# Altium project NG2092_R0M0E0.PrjPcb (part 8 of 8)

## Sheet NG2092_EEPROM.SchDoc: =project_title
size Tabloid; PageSetup: Record=PageOptions|CenterHorizontal=True|CenterVertical=True|PrintScale=0.73|XCorrection=1.00|YCorrection=1.00|PrintKind=0|BorderSize=5000000|LeftOffset=0|BottomOffset=0|Orientation=2|PaperLength=1000|PaperWidth=1000|Scale=100|PaperSource=7|PrintQuality=-4|MediaType=1|DitherType=10|PaperKind=A4|PrintScaleMode=1; CompanyName: Luxonis Holding; DrawnBy: Nejc Gostincar; Organization: Luxonis Holding; Address1: 1925 Harmony Park Drive; Address2: Westminster, CO; Address3: 80234; Address4: United States; DocumentNumber: DXXXX; Revision: R0M0E0; SheetNumber: 8; SheetTotal: 12
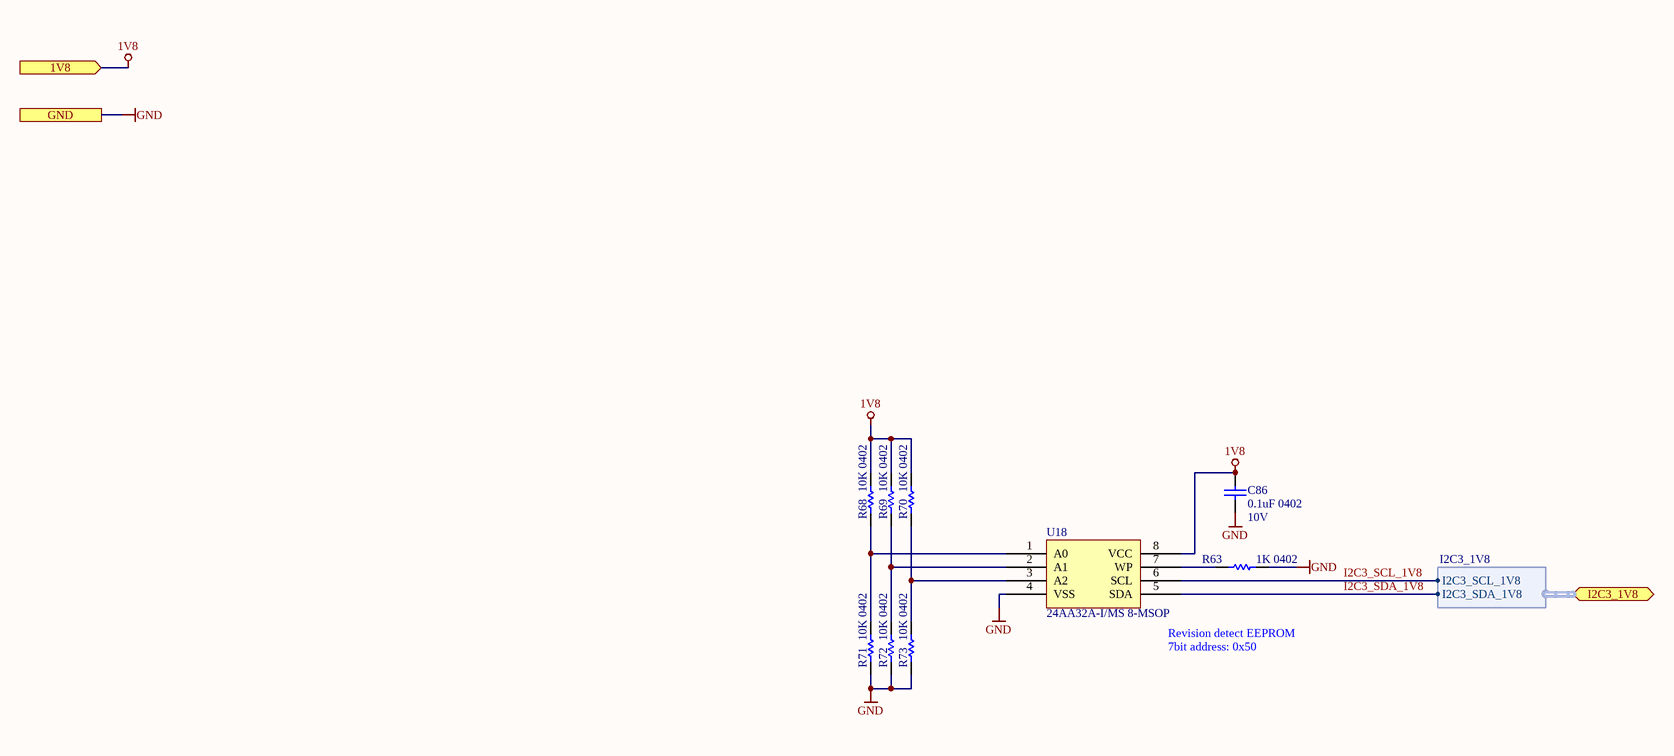
[diagram p17: NG2092_EEPROM.SchDoc]

### Parts
C86  0.1uF 0402  Voltage Rating: 10V  [CAPC0402(1005)70_L]
R63  1K 0402  [RESC0402(1005)_L]
R68  10K 0402  [RESC0402(1005)_L]
R69  10K 0402  [RESC0402(1005)_L]
R70  10K 0402  [RESC0402(1005)_L]
R71  10K 0402  [RESC0402(1005)_L]
R72  10K 0402  [RESC0402(1005)_L]
R73  10K 0402  [RESC0402(1005)_L]
U18  24AA32A-I/MS 8-MSOP  [24AA32A-I/MS]

### Ports
1V8 (in), GND, I2C3_1V8 (bidir, harness I2C3_1V8)

### Harnesses
I2C3_1V8: I2C3_SCL_1V8, I2C3_SDA_1V8

### Nets
1V8: C86.2 R68.2 R69.2 R70.2 U18.8(VCC) ; port 1V8
GND: C86.1 R63.1 R71.1 R72.1 R73.1 U18.4(VSS) ; port GND
I2C3_SCL_1V8: U18.6(SCL) ; port I2C3_1V8.I2C3_SCL_1V8
I2C3_SDA_1V8: U18.5(SDA) ; port I2C3_1V8.I2C3_SDA_1V8
NetR63_2: R63.2 U18.7(WP)
NetR68_1: R68.1 R71.2 U18.1(A0)
NetR69_1: R69.1 R72.2 U18.2(A1)
NetR70_1: R70.1 R73.2 U18.3(A2)

### Notes on the sheet
- (near U18) Revision detect EEPROM
- (near U18) 7bit address: 0x50
- Title
- Size:
- Date:
- Tabloid
- Number:
- Time:
- Revision:
- Sheet
- of
- Drawn by:

### Library data of the parts
C86 = GRM155R71A104JA01D: CAP CER 0.1UF 10V X7R 0402 5%; Manufacturer 1: Murata; Capacitance: 100nF; Supplier 1: Digi-Key; Manufacturer Part Number 1: GRM155R71A104JA01D; Stock 1: 1346709; Pricing 1: 1=0.10000, 10=0.02500, 100=0.01130, 500=0.00806, 1000=0.00633, 2500=0.00575, 5000=0.00529 (USD); RoHS: Yes; Mount: Surface Mount; Case/Package: 0402; Case Code (Imperial): 0402; Case Code (Metric): 1005; Min Operating Temperature: -55°C; Max Operating Temperature: 125°C; Tolerance: 5%; Packaging: Tape and Reel; Voltage Rating (DC): 10V; Dielectric: X7R; Package Quantity: 10000; Termination: SMD/SMT; Length: 1mm; Height: 0.5mm; Width: 0.02inch; Thickness: 0.022inch; Depth: 0.5mm; Radiation Hardening: No; Lead Free: Lead Free; ComponentLink1URL: https://datasheet.ciiva.com/5411/product-5411135.pdf?src-supplier=Mouser; ComponentLink1Description: https://datasheet.ciiva.com/5411/product-5411135.pdf?src-supplier=Mouser; ComponentLink2URL: https://datasheet.ciiva.com/11618/c02e-11618821.pdf?src-supplier=Avnet; ComponentLink2Description: https://datasheet.ciiva.com/11618/c02e-11618821.pdf?src-supplier=Avnet; Supplier Part Number 1: 490-10777-1-ND
R63 = RC0402FR-071KL: RES SMD 1K OHM 1% 1/16W 0402; Manufacturer 1: Yageo; Temperature Coefficient: 100ppm/°C; Power Rating: 62.5mW; Voltage Rating (DC): 50V; Resistance: 1kR; RoHS: Yes; Number of Pins: 2; Case Code (Imperial): 0402; Case Code (Metric): 1005; Min Operating Temperature: -55°C; Max Operating Temperature: 155°C; Packaging: Tape and Reel; Composition: Thick Film; Voltage Rating: 50V; Military Standard: Not; Termination: SMD/SMT; Length: 1mm; Height: 0.32mm; Width: 0.5mm; Depth: 0.5mm; Lead Free: Lead Free; REACH SVHC: Unknown; ComponentLink1URL: https://datasheet.ciiva.com/11819/0900766b80c66297-11819477.pdf?src-supplier=RSComponents; ComponentLink1Description: https://datasheet.ciiva.com/11819/0900766b80c66297-11819477.pdf?src-supplier=RSComponents; ComponentLink2URL: https://datasheet.ciiva.com/12666/pyu-rc0402-51-rohs-l-6-r-12666741.pdf?src-supplier=Mouser; ComponentLink2Description: https://datasheet.ciiva.com/12666/pyu-rc0402-51-rohs-l-6-r-12666741.pdf?src-supplier=Mouser; ComponentLink3URL: https://datasheet.ciiva.com/17063/pyu-rc0402-51-rohs-l-6-r-17063193.pdf?src-supplier=Future+Electronics; ComponentLink3Description: https://datasheet.ciiva.com/17063/pyu-rc0402-51-rohs-l-6-r-17063193.pdf?src-supplier=Future+Electronics; ComponentLink4URL: https://datasheet.ciiva.com/22747/1018594-22747513.pdf?src-supplier=Element14; ComponentLink4Description: https://datasheet.ciiva.com/22747/1018594-22747513.pdf?src-supplier=Element14; ComponentLink5URL: https://datasheet.ciiva.com/7849/1018594-7849869.pdf?src-supplier=Element14; ComponentLink5Description: https://datasheet.ciiva.com/7849/1018594-7849869.pdf?src-supplier=Element14; ComponentLink6URL: https://datasheet.ciiva.com/7983/1018594-7983502.pdf?src-supplier=Element14; ComponentLink6Description: https://datasheet.ciiva.com/7983/1018594-7983502.pdf?src-supplier=Element14; ComponentLink7URL: https://datasheet.ciiva.com/7849/1018594-7849871.pdf?src-supplier=Element14; ComponentLink7Description: https://datasheet.ciiva.com/7849/1018594-7849871.pdf?src-supplier=Element14; Supplier 1: Digi-Key; Manufacturer Part Number 1: RC0402FR-071KL; Stock 1: 60695854; Pricing 1: 1=0.10000, 10=0.01600, 100=0.00670, 1000=0.00301, 2500=0.00261, 5000=0.00215 (USD); Case/Package: 0402; Tolerance: 1%; Supplier Part Number 1: 311-1.00KLRCT-ND
R68-R73 = RC0402FR-1310KL: as R11-R14 on sheet NG2092_USB; ComponentLink1URL: https://datasheet.ciiva.com/16940/pyu-rc0402-51-rohs-l-6-16940293.pdf?src-supplier=Avnet+Europe; ComponentLink1Description: https://datasheet.ciiva.com/16940/pyu-rc0402-51-rohs-l-6-16940293.pdf?src-supplier=Avnet+Europe; ComponentLink2URL: https://datasheet.ciiva.com/28386/pyu-rc0402-51-rohs-l-6-28386855.pdf?src-supplier=Avnet+Europe; ComponentLink2Description: https://datasheet.ciiva.com/28386/pyu-rc0402-51-rohs-l-6-28386855.pdf?src-supplier=Avnet+Europe; ComponentLink3URL: https://datasheet.ciiva.com/16740/pyu-rc0402-51-rohs-l-6-r-16740602.pdf?src-supplier=Future+Electronics; ComponentLink3Description: https://datasheet.ciiva.com/16740/pyu-rc0402-51-rohs-l-6-r-16740602.pdf?src-supplier=Future+Electronics; ComponentLink4URL: https://datasheet.ciiva.com/8891/pyu-rc0402-51-rohs-l-6-8891339.pdf?src-supplier=Avnet; ComponentLink4Description: https://datasheet.ciiva.com/8891/pyu-rc0402-51-rohs-l-6-8891339.pdf?src-supplier=Avnet; ComponentLink5URL: https://datasheet.ciiva.com/5557/pyu-rc0402-51-rohs-l-6-r-5557997.pdf?src-supplier=Mouser; ComponentLink5Description: https://datasheet.ciiva.com/5557/pyu-rc0402-51-rohs-l-6-r-5557997.pdf?src-supplier=Mouser; ComponentLink6URL: https://datasheet.ciiva.com/7983/1018594-7983533.pdf?src-supplier=Element14; ComponentLink6Description: https://datasheet.ciiva.com/7983/1018594-7983533.pdf?src-supplier=Element14; Supplier 1: Newark; Manufacturer Part Number 1: RC0402FR-1310KL; Stock 1: 62239; Pricing 1: 1=0.10000, 25=0.01200, 100=0.00400, 250=0.00400, 500=0.00300, 1000=0.00300 (USD); RoHS: Yes; Case/Package: 0402; Number of Pins: 2; Contact Plating: Tin,Matte,Lead; Case Code (Imperial): 0402; Case Code (Metric): 1005; Min Operating Temperature: -55°C; Max Operating Temperature: 155°C; Tolerance: 1%; Composition: Thick Film; Packaging: Tape and Reel; Termination: SMD/SMT; Military Standard: Not; Voltage Rating (DC): 50V; Working Voltage: 50V; Number of Terminations: 2; Length: 1mm; Depth: 0.5mm; Radiation Hardening: No; REACH SVHC: No SVHC; Lead Free: Lead Free; Supplier Part Number 1: 67R9960; Supplier 2: Future Electronics; Supplier 3: Mouser; Supplier 4: Element14; Supplier Part Number 2: RC0402FR-1310KL-CUTT; Supplier Part Number 3: 603-RC0402FR-1310KL; Supplier Part Number 4: 1799235
U18 = 24AA32A-I/MS: IC EEPROM 32K I2C 400KHZ 8MSOP Memory IC 32Kb (4K x 8) I²C 400kHz 900ns 8-MSOP; Manufacturer 1: Microchip; Interface: I2C,Serial,2-Wire; Access Time: 3500ns; Max Supply Voltage: 5.5V; Min Supply Voltage: 1.7V; Nominal Supply Current: 3mA; Supplier 1: Digi-Key; Stock 1: 4213; Pricing 1: 1=0.39000, 25=0.38120, 100=0.36050 (USD); RoHS: Yes; Mount: Surface Mount; Case/Package: MSOP; Number of Pins: 8; Contact Plating: Tin,Matte; Min Operating Temperature: -40°C; Max Operating Temperature: 85°C; Max Frequency: 400kHz; Frequency: 400kHz; Packaging: Rail/Tube; Density: 32Kb; Memory Size: 32Kb; Package Quantity: 100; Length: 3mm; Height: 0.85mm; Width: 3mm; Radiation Hardening: No; Lead Free: Lead Free; REACH SVHC: No SVHC; ComponentLink1URL: https://datasheet.ciiva.com/16309/filehandler-aspxddocname-en011853-16309808.pdf?src-supplier=Future+Electronics; ComponentLink1Description: https://datasheet.ciiva.com/16309/filehandler-aspxddocname-en011853-16309808.pdf?src-supplier=Future+Electronics; ComponentLink2URL: https://datasheet.ciiva.com/16621/21713l-16621382.pdf?src-supplier=Avnet+Europe; ComponentLink2Description: https://datasheet.ciiva.com/16621/21713l-16621382.pdf?src-supplier=Avnet+Europe; ComponentLink3URL: https://datasheet.ciiva.com/3185/21713l-3185209.pdf?src-supplier=Avnet; ComponentLink3Description: https://datasheet.ciiva.com/3185/21713l-3185209.pdf?src-supplier=Avnet; ComponentLink4URL: https://datasheet.ciiva.com/1154/1688094-1154810.pdf?src-supplier=Element14; ComponentLink4Description: https://datasheet.ciiva.com/1154/1688094-1154810.pdf?src-supplier=Element14; ComponentLink5URL: https://datasheet.ciiva.com/41454/001085239-da-01-en-ic-eeprom-32kbit-24aa32a-i-ms-msop-8-mcp-41454934.pdf?src-supplier=Conrad; ComponentLink5Description: https://datasheet.ciiva.com/41454/001085239-da-01-en-ic-eeprom-32kbit-24aa32a-i-ms-msop-8-mcp-41454934.pdf?src-supplier=Conrad; Supplier Part Number 1: 24AA32A-I/MS-ND; Memory Type: EEPROM; Manufacturer Part Number 1: 24AA32A-I/MS; Supplier 2: Mouser; Supplier 3: Newark; Supplier Part Number 2: 579-24AA32A-I/MS; Supplier Part Number 3: 38AH9658

## Nets that join several sheets
1V2: NG2092_Power_Supply (C39.2 TP3.1 U8.5), NG2092_RIGHT_OV9282 (FB9.1), NG2092_LEFT_OV9282 (FB6.1)
1V05: NG2092_Power_Supply (5 pins), NG2092_IMX378 (FB3.1)
1V8: NG2092_Power_Supply (C18.2 TP4.1 U2.5), NG2092_IMX378 (FB2.1), NG2092_RIGHT_OV9282 (FB8.1), NG2092_LEFT_OV9282 (FB5.1), NG2092_IMU (10 pins), NG2092_LEVEL_SHIFT (9 pins), NG2092_Connector_B (R22.2 R23.2), NG2092_MICS (L10.1 L11.1 L12.1), NG2092_SPEAKERS (6 pins), NG2092_EEPROM (5 pins)
2V8: NG2092_Power_Supply (C20.2 TP5.1 U3.5), NG2092_IMX378 (FB1.1), NG2092_RIGHT_OV9282 (FB7.1), NG2092_LEFT_OV9282 (FB4.1)
3V3: NG2092_Power_Supply (C16.1 L2.2 R5.2 TP6.1), NG2092_USB (C35.2 R13.2 U5.6), NG2092_ESP32 (C55.2 C56.2 R41.2 U11.2), NG2092_IMU (C42.2 C44.2 U12.3), NG2092_QWIIC (J11.3), NG2092_LEVEL_SHIFT (6 pins), NG2092_USB_HUB (16 pins), NG2092_SD_Card (C73.2 J1.4), NG2092_SPEAKERS (C96.2 C97.2 U17.10)
GND: NG2092_TopLevel (MP1.1 MP2.1 MP5.1 MP7.1), NG2092_Power_Supply (30 pins), NG2092_Connector_A (33 pins), NG2092_IMX378 (18 pins), NG2092_RIGHT_OV9282 (18 pins), NG2092_LEFT_OV9282 (18 pins), NG2092_USB (27 pins), NG2092_ESP32 (15 pins), NG2092_IMU (10 pins), NG2092_QWIIC (J11.4 J11.S1 J11.S2), NG2092_LEVEL_SHIFT (15 pins), NG2092_Connector_B (31 pins), NG2092_MICS (21 pins), NG2092_USB_HUB (22 pins), NG2092_SD_Card (8 pins), NG2092_SPEAKERS (23 pins), NG2092_EEPROM (6 pins)
VBUS: NG2092_Power_Supply (TP2.1 U9.1 U10.3), NG2092_USB (9 pins), NG2092_ESP32 (R42.2 U15.7), NG2092_Connector_B (J13.80), NG2092_USB_HUB (R51.2)
VDD_5V: NG2092_Power_Supply (21 pins), NG2092_Connector_A (R32.2 R33.2 R34.2), NG2092_USB (5 pins), NG2092_Connector_B (8 pins), NG2092_SPEAKERS (7 pins)
BNO08x_BOOTN_1V8: NG2092_IMU (R36.1), NG2092_Connector_B (J13.42)
BNO08x_INT_1V8: NG2092_Connector_A (J12.69), NG2092_IMU (R30.1 U12.14)
BNO08x_RSTn_1V8: NG2092_IMU (R29.1 U12.11), NG2092_Connector_B (J13.44)
CAM_A_CLK_OUT: NG2092_Connector_A (J12.28), NG2092_IMX378 (J2.3)
CAM_A_PWDN_N: NG2092_Connector_A (J12.34), NG2092_IMX378 (J2.9 R27.1)
CAM_B_CLK_OUT: NG2092_Connector_A (J12.73), NG2092_RIGHT_OV9282 (J9.3), NG2092_LEFT_OV9282 (J3.3)
CAM_B_D_PWM: NG2092_Connector_A (J12.65), NG2092_RIGHT_OV9282 (J9.9 R49.1)
CAM_B_PWDN_N: NG2092_Connector_A (J12.67), NG2092_LEFT_OV9282 (J3.9 R2.1)
COM_AUX_IO2: NG2092_Connector_A (J12.42), NG2092_LEFT_OV9282 (R4.1)
ESP_GPIO2_D0: NG2092_ESP32 (J6.2 U11.24), NG2092_LEVEL_SHIFT (U14.20)
ESP_GPIO4_D1: NG2092_ESP32 (J6.3 U11.26), NG2092_LEVEL_SHIFT (U14.18)
ESP_GPIO12_D2: NG2092_ESP32 (J6.4 U11.14), NG2092_LEVEL_SHIFT (U14.17)
ESP_GPIO13_D3: NG2092_ESP32 (J6.5 U11.16), NG2092_LEVEL_SHIFT (U14.16)
ESP_GPIO14_CLK: NG2092_ESP32 (J6.6 U11.13), NG2092_LEVEL_SHIFT (U14.15)
ESP_GPIO15_CS0: NG2092_ESP32 (J6.7 U11.23), NG2092_LEVEL_SHIFT (U14.14)
ESP_GPIO27: NG2092_ESP32 (U11.12), NG2092_LEVEL_SHIFT (U13.20)
FSIN2: NG2092_RIGHT_OV9282 (J9.8), NG2092_LEFT_OV9282 (R26.2)
FSIN3: NG2092_IMX378 (J2.8), NG2092_LEFT_OV9282 (R9.1)
GPIO8/SPI0_CS_1: NG2092_Connector_A (J12.60), NG2092_IMU (U12.18), NG2092_LEVEL_SHIFT (U13.1)
I2C1_SCL: NG2092_Connector_A (J12.35), NG2092_IMX378 (J2.7)
I2C1_SDA: NG2092_Connector_A (J12.33), NG2092_IMX378 (J2.5)
I2C2_SCL: NG2092_Connector_A (J12.77), NG2092_RIGHT_OV9282 (J9.7), NG2092_LEFT_OV9282 (J3.7)
I2C2_SDA: NG2092_Connector_A (J12.79), NG2092_RIGHT_OV9282 (J9.5), NG2092_LEFT_OV9282 (J3.5)
I2C3_SCL_1V8: NG2092_Connector_A (J12.78), NG2092_LEVEL_SHIFT (U7.7), NG2092_SPEAKERS (U17.9), NG2092_EEPROM (U18.6)
I2C3_SCL_3V3: NG2092_ESP32 (U11.10), NG2092_QWIIC (J11.1), NG2092_LEVEL_SHIFT (U7.14)
I2C3_SDA_1V8: NG2092_Connector_A (J12.80), NG2092_LEVEL_SHIFT (U7.8), NG2092_SPEAKERS (U17.3), NG2092_EEPROM (U18.5)
I2C3_SDA_3V3: NG2092_ESP32 (U11.11), NG2092_QWIIC (J11.2), NG2092_LEVEL_SHIFT (U7.13)
I2S2_IN_SD0: NG2092_Connector_B (J13.21 R74.1), NG2092_MICS (MIC1.6 MIC2.6)
I2S2_IN_SD1: NG2092_Connector_B (J13.25 R10.1), NG2092_MICS (MIC3.6 MIC4.6)
I2S2_IN_SD2: NG2092_Connector_B (J13.27 R75.1), NG2092_MICS (MIC5.6 MIC6.6)
I2S2_OUT_SD0: NG2092_Connector_B (J13.23), NG2092_SPEAKERS (U17.6)
I2S2_SCK: NG2092_Connector_B (J13.17), NG2092_MICS (6 pins), NG2092_SPEAKERS (U17.7)
I2S2_WS: NG2092_Connector_B (J13.19), NG2092_MICS (6 pins), NG2092_SPEAKERS (U17.5)
MIPI_RX2_C_N: NG2092_Connector_A (J12.95), NG2092_LEFT_OV9282 (J3.20)
MIPI_RX2_C_P: NG2092_Connector_A (J12.97), NG2092_LEFT_OV9282 (J3.19)
MIPI_RX2_D0_N: NG2092_Connector_A (J12.89), NG2092_LEFT_OV9282 (J3.26)
MIPI_RX2_D0_P: NG2092_Connector_A (J12.91), NG2092_LEFT_OV9282 (J3.25)
MIPI_RX2_D1_N: NG2092_Connector_A (J12.83), NG2092_LEFT_OV9282 (J3.22)
MIPI_RX2_D1_P: NG2092_Connector_A (J12.85), NG2092_LEFT_OV9282 (J3.23)
MIPI_RX3_C_N: NG2092_Connector_A (J12.96), NG2092_RIGHT_OV9282 (J9.20)
MIPI_RX3_C_P: NG2092_Connector_A (J12.98), NG2092_RIGHT_OV9282 (J9.19)
MIPI_RX3_D0_N: NG2092_Connector_A (J12.90), NG2092_RIGHT_OV9282 (J9.26)
MIPI_RX3_D0_P: NG2092_Connector_A (J12.92), NG2092_RIGHT_OV9282 (J9.25)
MIPI_RX3_D1_N: NG2092_Connector_A (J12.84), NG2092_RIGHT_OV9282 (J9.22)
MIPI_RX3_D1_P: NG2092_Connector_A (J12.86), NG2092_RIGHT_OV9282 (J9.23)
MIPI_RX4_C_N: NG2092_Connector_A (J12.3), NG2092_IMX378 (J2.20)
MIPI_RX4_C_P: NG2092_Connector_A (J12.5), NG2092_IMX378 (J2.19)
MIPI_RX4_D0_N: NG2092_Connector_A (J12.9), NG2092_IMX378 (J2.26)
MIPI_RX4_D0_P: NG2092_Connector_A (J12.11), NG2092_IMX378 (J2.25)
MIPI_RX4_D1_N: NG2092_Connector_A (J12.15), NG2092_IMX378 (J2.22)
MIPI_RX4_D1_P: NG2092_Connector_A (J12.17), NG2092_IMX378 (J2.23)
MIPI_RX5_D0_N: NG2092_Connector_A (J12.21), NG2092_IMX378 (J2.16)
MIPI_RX5_D0_P: NG2092_Connector_A (J12.23), NG2092_IMX378 (J2.17)
MIPI_RX5_D1_N: NG2092_Connector_A (J12.27), NG2092_IMX378 (J2.14)
MIPI_RX5_D1_P: NG2092_Connector_A (J12.29), NG2092_IMX378 (J2.13)
MX_INT_1V8: NG2092_Connector_A (J12.59), NG2092_LEVEL_SHIFT (U7.4)
MX_INT_3V3: NG2092_ESP32 (U11.8), NG2092_LEVEL_SHIFT (U7.17)
MX_RST_1V8: NG2092_Connector_A (J12.39 Q2.1 SW1.2), NG2092_LEVEL_SHIFT (U7.1)
MX_RST_3V3: NG2092_ESP32 (U11.9), NG2092_LEVEL_SHIFT (U7.20)
SD0_CLK_3V3: NG2092_Connector_A (J12.61), NG2092_SD_Card (D9.1 J1.5)
SD0_CMD_3V3: NG2092_Connector_A (J12.63), NG2092_SD_Card (D5.3 J1.3)
SD0_D0_3V3: NG2092_Connector_A (J12.40), NG2092_SD_Card (D9.3 J1.7)
SD0_D1_3V3: NG2092_Connector_A (J12.38), NG2092_SD_Card (D9.5 J1.8)
SD0_D2_3V3: NG2092_Connector_A (J12.36), NG2092_SD_Card (D5.1 J1.1)
SD0_D3_3V3: NG2092_Connector_A (J12.32), NG2092_SD_Card (D5.5 J1.2)
SPI0_CS_0: NG2092_Connector_A (J12.70), NG2092_LEVEL_SHIFT (U13.8)
SPI0_SCK: NG2092_Connector_A (J12.74), NG2092_IMU (U12.19), NG2092_LEVEL_SHIFT (U13.7)
SPI0_SIO0: NG2092_Connector_A (J12.62), NG2092_IMU (U12.17), NG2092_LEVEL_SHIFT (U13.3)
SPI0_SIO1: NG2092_Connector_A (J12.64), NG2092_IMU (U12.20), NG2092_LEVEL_SHIFT (U13.4)
SPI0_SIO2: NG2092_Connector_A (J12.66), NG2092_LEVEL_SHIFT (U13.5)
SPI0_SIO3: NG2092_Connector_A (J12.68), NG2092_LEVEL_SHIFT (U13.6)
SPI1_CLK_1V8: NG2092_LEVEL_SHIFT (U14.6), NG2092_Connector_B (J13.72)
SPI1_CS0_1V8: NG2092_LEVEL_SHIFT (U14.7), NG2092_Connector_B (J13.74)
SPI1_D0_1V8: NG2092_LEVEL_SHIFT (U14.1), NG2092_Connector_B (J13.66)
SPI1_D1_1V8: NG2092_LEVEL_SHIFT (U14.3), NG2092_Connector_B (J13.68)
SPI1_D2_1V8: NG2092_LEVEL_SHIFT (U14.4), NG2092_Connector_B (J13.70)
SPI1_D3_1V8: NG2092_LEVEL_SHIFT (U14.5), NG2092_Connector_B (J13.50)
SPKR_MCLK: NG2092_Connector_B (J13.28), NG2092_SPEAKERS (U17.8)
USB_D_N: NG2092_USB (D6.1 D6.10 J10.A7 J10.B7), NG2092_USB_HUB (U16.30)
USB_D_P: NG2092_USB (D6.2 D6.9 J10.A6 J10.B6), NG2092_USB_HUB (U16.31)
USB_ESP_D_N: NG2092_ESP32 (U15.5), NG2092_USB_HUB (U16.3)
USB_ESP_D_P: NG2092_ESP32 (U15.4), NG2092_USB_HUB (U16.4)
USB_MX_D_N: NG2092_Connector_B (J13.90), NG2092_USB_HUB (U16.1)
USB_MX_D_P: NG2092_Connector_B (J13.92), NG2092_USB_HUB (U16.2)
USB_RX_N: NG2092_USB (U5.7), NG2092_Connector_B (J13.96)
USB_RX_P: NG2092_USB (U5.8), NG2092_Connector_B (J13.98)
USB_TX_N: NG2092_USB (U5.3), NG2092_Connector_B (J13.84)
USB_TX_P: NG2092_USB (U5.4), NG2092_Connector_B (J13.86)
VSPI_CS0: NG2092_ESP32 (U11.29), NG2092_LEVEL_SHIFT (U13.13)
VSPI_HOLDn_SIO3: NG2092_ESP32 (U11.33), NG2092_LEVEL_SHIFT (U13.15)
VSPI_SCK: NG2092_ESP32 (U11.30), NG2092_LEVEL_SHIFT (U13.14)
VSPI_SDI_SIO1: NG2092_ESP32 (U11.31), NG2092_LEVEL_SHIFT (U13.17)
VSPI_SDO_SIO0: NG2092_ESP32 (U11.37), NG2092_LEVEL_SHIFT (U13.18)
VSPI_WPn_SIO2: NG2092_ESP32 (U11.36), NG2092_LEVEL_SHIFT (U13.16)

## Assembly variants
Production: not fitted R18 R19 R53 R55 R68 R69 R70